# EAGLE schematic newt_mkr_v1_r1 (EAGLE 9.6.2)
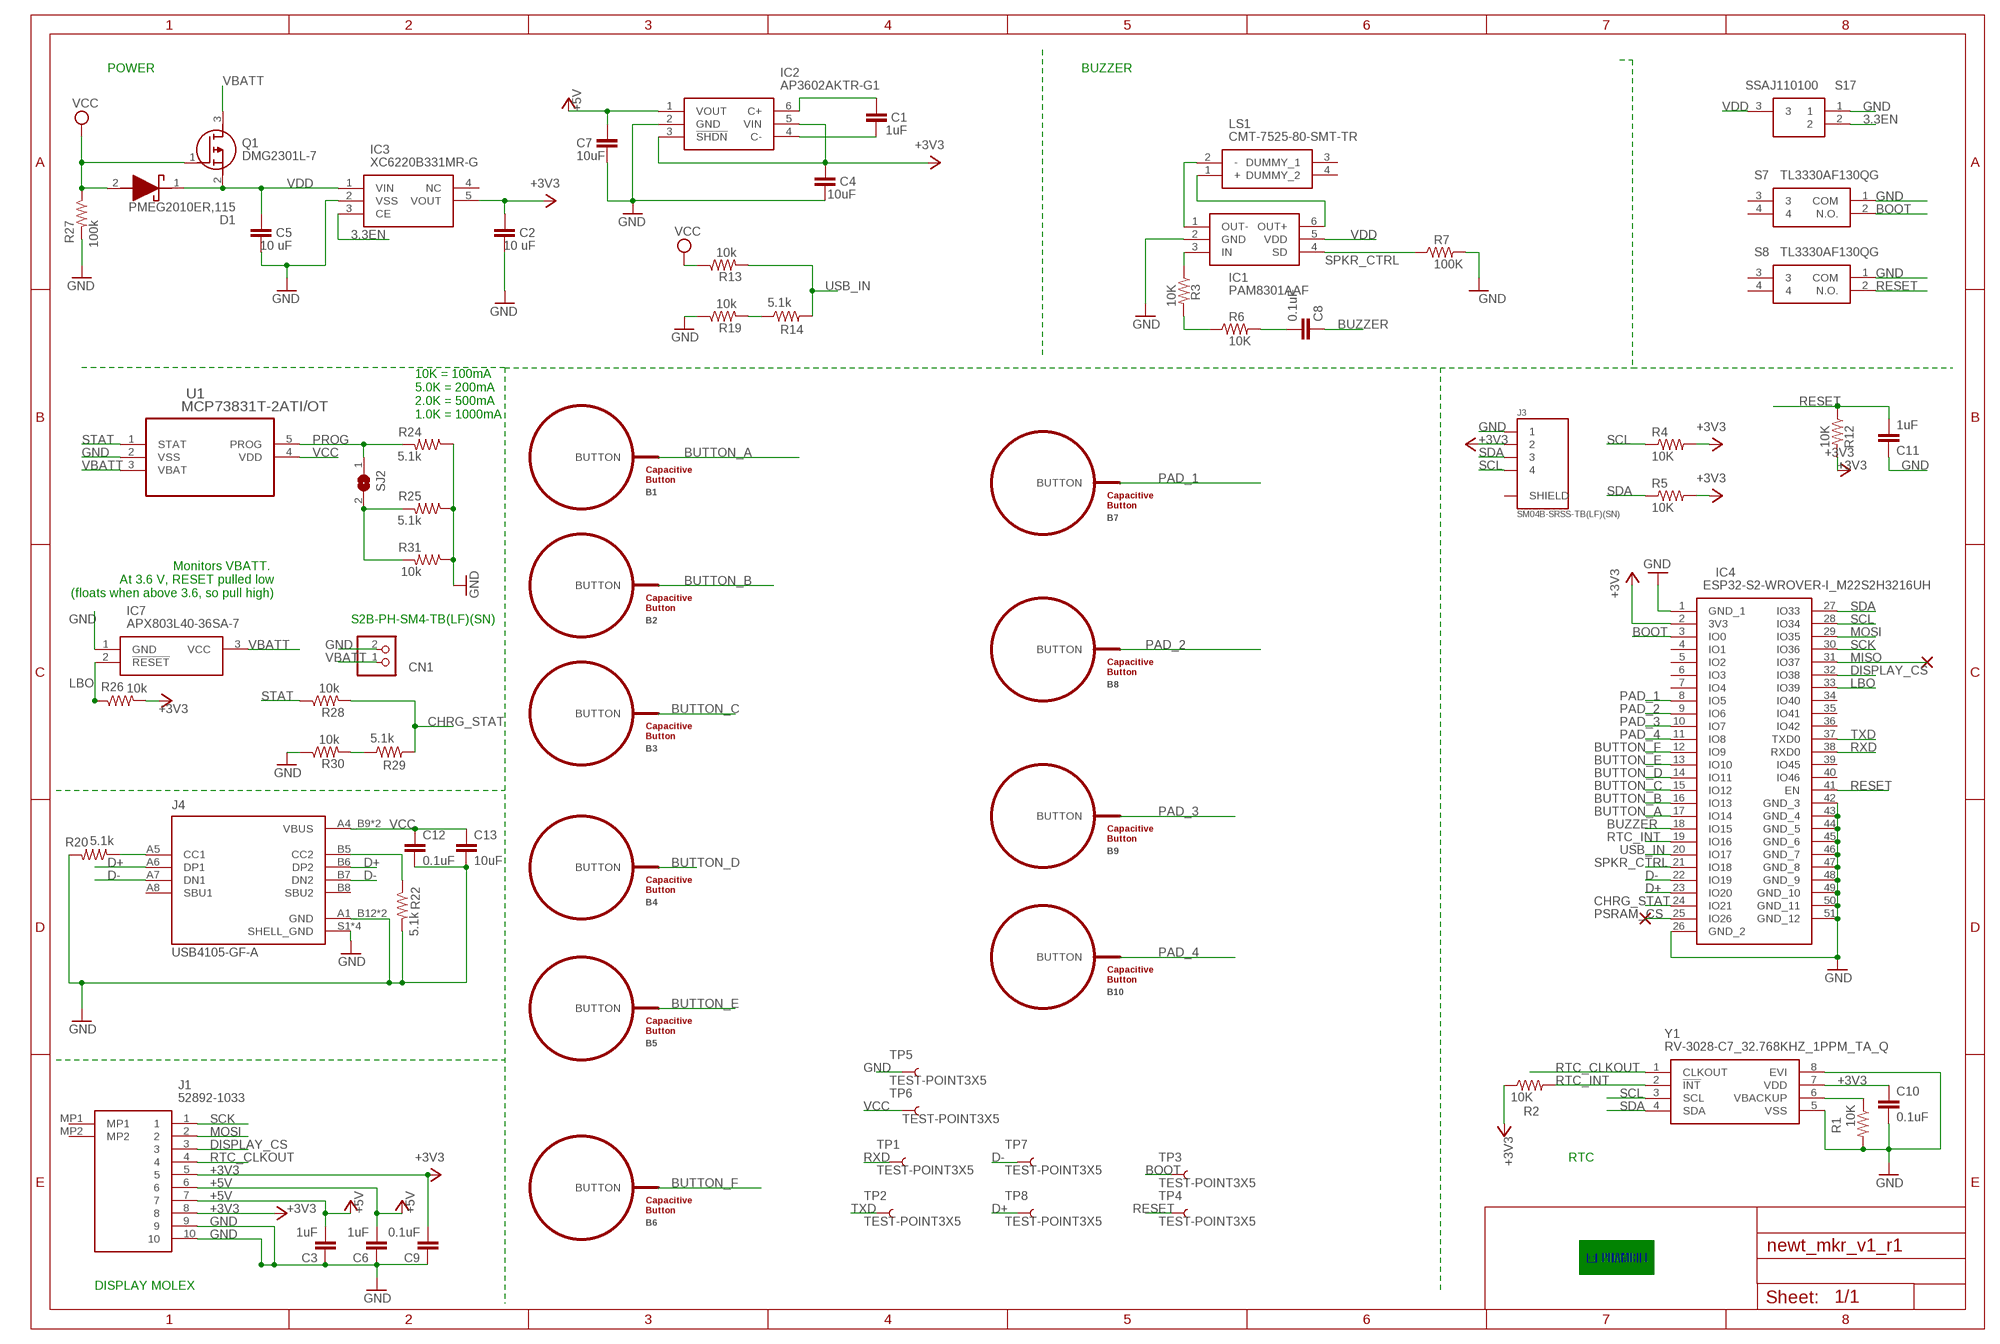
[diagram p0: schematic, sheet 1]

## Parts
B1  BUTTON_PASSIVE6MM  [BUTTON_PASSIVE_6MM]
B2  BUTTON_PASSIVE6MM  [BUTTON_PASSIVE_6MM]
B3  BUTTON_PASSIVE6MM  [BUTTON_PASSIVE_6MM]
B4  BUTTON_PASSIVE6MM  [BUTTON_PASSIVE_6MM]
B5  BUTTON_PASSIVE6MM  [BUTTON_PASSIVE_6MM]
B6  BUTTON_PASSIVE6MM  [BUTTON_PASSIVE_6MM]
B7  BUTTON_PASSIVE10MM  [BUTTON_PASSIVE_10MM]
B8  BUTTON_PASSIVE10MM  [BUTTON_PASSIVE_10MM]
B9  BUTTON_PASSIVE10MM  [BUTTON_PASSIVE_10MM]
B10  BUTTON_PASSIVE10MM  [BUTTON_PASSIVE_10MM]
C1  1uF  CC0603  [C0603]
C2  10 uF  CC0603  [C0603]
C3  1uF  CC0603  [C0603]
C4  10uF  CC0603  [C0603]
C5  10 uF  CC0603  [C0603]
C6  1uF  CC0603  [C0603]
C7  10uF  CC0603  [C0603]
C8  0.1uF  CC0603  [C0603]
C9  0.1uF  CC0603  [C0603]
C10  0.1uF  CC0603  [C0603]
C11  1uF  CC0603  [C0603]
C12  0.1uF  CC0603  [C0603]
C13  10uF  CC0603  [C0603]
CN1  JST_2PIN-SMT-RA  [JST-PH-2-SMT-RA]
D1  PMEG2010ER,115  [SODFL3517X110N]
IC1  PAM8301AAF  [SOT95P280X145-6N]
IC2  AP3602AKTR-G1  [SOT95P280X145-6N]
IC3  XC6220B331MR-G  [SOT95P280X130-5N]
IC4  ESP32-S2-WROVER-I_M22S2H3216UH  [ESP32S2WROVERIM22S2H3216UH3Q0]
IC7  APX803L40-36SA-7  [SOT96P240X110-3N]
J1  52892-1033  [528921033]
J3  SM04B-SRSS-TB(LF)(SN)  [JST_SM04B-SRSS-TB(LF)(SN)]
J4  USB4105-GF-A  [GCT_USB4105-GF-A]
LS1  CMT-7525-80-SMT-TR  [CMT752580SMTTR]
Q1  DMG2301L-7  [SOT96P240X110-3N]
R1  10K  R-US_R0603  [R0603]
R2  10K  R-US_R0603  [R0603]
R3  10K  R-US_R0603  [R0603]
R4  10K  R-US_R0603  [R0603]
R5  10K  R-US_R0603  [R0603]
R6  10K  R-US_R0603  [R0603]
R7  100K  R-US_R0603  [R0603]
R12  10K  R-US_R0603  [R0603]
R13  10k  R-US_R0603  [R0603]
R14  5.1k  R-US_R0603  [R0603]
R19  10k  R-US_R0603  [R0603]
R20  5.1k  R-US_R0603  [R0603]
R22  5.1k  R-US_R0603  [R0603]
R24  5.1k  R-US_R0603  [R0603]
R25  5.1k  R-US_R0603  [R0603]
R26  10k  R-US_R0603  [R0603]
R27  100k  R-US_R0603  [R0603]
R28  10k  R-US_R0603  [R0603]
R29  5.1k  R-US_R0603  [R0603]
R30  10k  R-US_R0603  [R0603]
R31  10k  R-US_R0603  [R0603]
S7  TL3330AF130QG  [TL3330AF130QG]
S8  TL3330AF130QG  [TL3330AF130QG]
S17  SSAJ110100  [SSAJ110100_1]
SJ2  MICROBUILDER_SOLDERJUMPERCLOSED  [MICROBUILDER_SOLDERJUMPER_CLOSEDWIRE]
TP1  TEST-POINT3X5  [PAD.03X.05]
TP2  TEST-POINT3X5  [PAD.03X.05]
TP3  TEST-POINT3X5  [PAD.03X.05]
TP4  TEST-POINT3X5  [PAD.03X.05]
TP5  TEST-POINT3X5  [PAD.03X.05]
TP6  TEST-POINT3X5  [PAD.03X.05]
TP7  TEST-POINT3X5  [PAD.03X.05]
TP8  TEST-POINT3X5  [PAD.03X.05]
U1  MCP73831T-2ATI/OT  [SOT95P300X145-5N]
Y1  RV-3028-C7_32.768KHZ_1PPM_TA_Q  [RV-8803-C7]

## Nets
3.3EN: IC3.3(CE) S17.2
+3V3: C2.2 C4.2 C9.2 C10.1 IC2.3(!SHDN) IC2.5(VIN) IC3.5(VOUT) IC4.2(3V3) J1.5 J1.8 J3.2 R2.1 R4.2 R5.2 R12.2 R26.2 Y1.7(VDD)
+5V: C3.2 C6.2 C7.2 IC2.1(VOUT) J1.6 J1.7
BOOT: IC4.3(IO0) S7.2(N.O.) TP3.P$1
BUTTON_A: B1.BUTTON IC4.17(IO14)
BUTTON_B: B2.BUTTON IC4.16(IO13)
BUTTON_C: B3.BUTTON IC4.15(IO12)
BUTTON_D: B4.BUTTON IC4.14(IO11)
BUTTON_E: B5.BUTTON IC4.13(IO10)
BUTTON_F: B6.BUTTON IC4.12(IO9)
BUZZER: C8.1 IC4.18(IO15)
CC2: J4.B5(CC2) R22.1
CHRG_STAT: IC4.24(IO21) R28.2 R29.2
D+: IC4.23(IO20) J4.A6(DP1) J4.B6(DP2) TP8.P$1
D-: IC4.22(IO19) J4.A7(DN1) J4.B7(DN2) TP7.P$1
DISPLAY_CS: IC4.32(IO38) J1.3
GND: C2.1 C3.1 C4.1 C5.1 C6.1 C7.1 C9.1 C10.2 C11.1 C12.2 C13.2 CN1.2 IC1.2(GND) IC2.2(GND) IC3.2(VSS) IC4.1(GND_1) IC4.26(GND_2) IC4.42(GND_3) IC4.43(GND_4) IC4.44(GND_5) IC4.45(GND_6) IC4.46(GND_7) IC4.47(GND_8) IC4.48(GND_9) IC4.49(GND_10) IC4.50(GND_11) IC4.51(GND_12) IC7.1(GND) J1.9 J1.10 J3.1 J4.A1_B12(GND) J4.B1_A12(GND) J4.S1(SHELL_GND) J4.S2(SHELL_GND) J4.S3(SHELL_GND) J4.S4(SHELL_GND) R1.2 R7.2 R19.1 R20.2 R22.2 R24.1 R25.1 R27.2 R30.1 R31.1 S7.1(COM) S8.1(COM) S17.1 TP5.P$1 U1.2(VSS) Y1.5(VSS) Y1.8(EVI)
LBO: IC4.33(IO39) IC7.2(!RESET) R26.1
MISO: IC4.31(IO37)
MOSI: IC4.29(IO35) J1.2
N$1: IC1.6(OUT+) LS1.1(+)
N$2: IC1.1(OUT-) LS1.2(-)
N$3: R1.1 Y1.6(VBACKUP)
N$4: R14.1 R19.2
N$5: C1.2 IC2.6(C+)
N$6: C1.1 IC2.4(C-)
N$7: IC1.3(IN) R3.1
N$8: R29.1 R30.2
N$11: R25.2 R31.2 SJ2.2
N$12: R3.2 R6.1
N$13: C8.2 R6.2
N$15: J4.A5(CC1) R20.1
PAD_1: B7.BUTTON IC4.8(IO5)
PAD_2: B8.BUTTON IC4.9(IO6)
PAD_3: B9.BUTTON IC4.10(IO7)
PAD_4: B10.BUTTON IC4.11(IO8)
PROG: R24.2 SJ2.1 U1.5(PROG)
PSRAM_CS: IC4.25(IO26)
RESET: C11.2 IC4.41(EN) R12.1 S8.2(N.O.) TP4.P$1
RTC_CLKOUT: J1.4 Y1.1(CLKOUT)
RTC_INT: IC4.19(IO16) R2.2 Y1.2(!INT)
RXD: IC4.38(RXD0) TP1.P$1
SCK: IC4.30(IO36) J1.1
SCL: IC4.28(IO34) J3.4 R4.1 Y1.3(SCL)
SDA: IC4.27(IO33) J3.3 R5.1 Y1.4(SDA)
SPKR_CTRL: IC1.4(SD) IC4.21(IO18) R7.1
STAT: R28.1 U1.1(STAT)
TXD: IC4.37(TXD0) TP2.P$1
USB_IN: IC4.20(IO17) R13.2 R14.2
VBATT: CN1.1 IC7.3(VCC) Q1.3(D) U1.3(VBAT)
VCC: C12.1 C13.1 D1.2(A) J4.A4_B9(VBUS) J4.B4_A9(VBUS) Q1.1(G) R13.1 R27.1 TP6.P$1 U1.4(VDD)
VDD: C5.2 D1.1(K) IC1.5(VDD) IC3.1(VIN) Q1.2(S) S17.3
Unconnected: IC3.4(NC) IC4.4(IO1) IC4.5(IO2) IC4.6(IO3) IC4.7(IO4) IC4.34(IO40) IC4.35(IO41) IC4.36(IO42) IC4.39(IO45) IC4.40(IO46) J1.MP1 J1.MP2 J3.S1(SHIELD) J3.S2(SHIELD) J4.A8(SBU1) J4.B8(SBU2) LS1.3(DUMMY_1) LS1.4(DUMMY_2) S7.3 S7.4 S8.3 S8.4

## Notes on the sheet
- POWER | BUZZER
- 10K = 100mA
  5.0K = 200mA
  2.0K = 500mA
  1.0K = 1000mA
- Monitors VBATT. 
  At 3.6 V, RESET pulled low
  (floats when above 3.6, so pull high)
- S2B-PH-SM4-TB(LF)(SN)‎
- RTC
- DISPLAY MOLEX

## Library data of the parts
B1-B10 = PatternAgents-TouchWidgets:BUTTON_PASSIVE: Button, Passive Capacitive/Touch Sensing Type Source : http://www.PatternAgents.com Github : https://github.com/PatternAgents License : http://creativecommons.org/licenses/by-sa/3.1/ (Creative Commons 3.1) THIS SOFTWARE IS PROVIDED BY THE CONTRIBUTORS "AS IS" AND WITHOUT ANY EXPRESS OR IMPLIED WARRANTIES, INCLUDING, BUT NOT LIMITED TO, THE IMPLIED WARRANTIES OF MERCHANTABILITY AND FITNESS FOR A PARTICULAR PURPOSE ARE DISCLAIMED. IN NO EVENT SHALL THE COPYRIGHT OWNER OR CONTRIBUTORS BE LIABLE FOR ANY DIRECT, INDIRECT, INCIDENTAL, SPECIAL, EXEMPLARY, OR CONSEQUENTIAL DAMAGES (INCLUDING, BUT NOT LIMITED TO, PROCUREMENT OF SUBSTITUTE GOODS OR SERVICES; LOSS OF USE, DATA, OR PROFITS; OR BUSINESS INTERRUPTION) HOWEVER CAUSED AND ON ANY THEORY OF LIABILITY, WHETHER IN CONTRACT, STRICT LIABILITY, OR TORT (INCLUDING NEGLIGENCE OR OTHERWISE) ARISING IN ANY WAY OUT OF THE USE OF THIS SOFTWARE, EVEN IF ADVISED OF THE POSSIBILITY OF SUCH DAMAGE.
C1-C13 = eagle-ltspice:C: CAPACITOR, European symbol; SPICEMODEL: NONE; SPICEPREFIX: C
CN1 = adafruit:JST_2PIN: JST 2-Pin Connectors of various flavors SMT-RA (S2B-PH-SM4) 4UConnector #17311 SMT (B2B-PH-SM4) THM-RA (S2B-PH) THM (B2B-PH)
D1 = PMEG2010ER_115:PMEG2010ER,115: NXP PMEG2010ER,115 SMT Schottky Diode, 20V 1A, 2-Pin SOD-123 Source: Datasheet <https://assets.nexperia.com/documents/data-sheet/PMEG2010ER.pdf>; DESCRIPTION: NXP PMEG2010ER,115 SMT Schottky Diode, 20V 1A, 2-Pin SOD-123; HEIGHT: 1.1mm; MANUFACTURER_NAME: Nexperia; MANUFACTURER_PART_NUMBER: PMEG2010ER,115; MOUSER_PART_NUMBER: 771-PMEG2010ER115; MOUSER_PRICE-STOCK: https://www.mouser.co.uk/ProductDetail/Nexperia/PMEG2010ER115?qs=LMSg3oBIm%2FjLN28PGE8ULg%3D%3D
IC1 = PAM8301AAF:PAM8301AAF: Audio Amplifiers 1.5W MONO FILTERLESS CLASS-D AUDIO AMP Source: Datasheet <https://www.diodes.com/assets/Datasheets/PAM8301.pdf>; DESCRIPTION: Audio Amplifiers 1.5W MONO FILTERLESS CLASS-D AUDIO AMP; HEIGHT: 1.45mm; MANUFACTURER_NAME: Diodes Inc.; MANUFACTURER_PART_NUMBER: PAM8301AAF; MOUSER_PART_NUMBER: 621-PAM8301AAF; MOUSER_PRICE-STOCK: https://www.mouser.co.uk/ProductDetail/Diodes-Incorporated/PAM8301AAF?qs=pYVYkI7xuRV6vlW3YKulRw%3D%3D
IC2 = AP3602AKTR-G1:AP3602AKTR-G1: Switching Voltage Regulators LED Backlight Source: Datasheet <https://media.digikey.com/pdf/Data Sheets/Diodes PDFs/AP3602A_B.pdf>; DESCRIPTION: Switching Voltage Regulators LED Backlight; HEIGHT: 1.45mm; MANUFACTURER_NAME: Diodes Inc.; MANUFACTURER_PART_NUMBER: AP3602AKTR-G1; MOUSER_PART_NUMBER: 621-AP3602AKTR-G1; MOUSER_PRICE-STOCK: https://www.mouser.co.uk/ProductDetail/Diodes-Incorporated/AP3602AKTR-G1?qs=5V6w%252Be2aIqZe7SZnxovZqw%3D%3D
IC3 = XC6220B331MR-G:XC6220B331MR-G: TOREX - XC6220B331MR-G - IC, LDO, 1A, 3.3V, SOT-25 Source: Datasheet <https://media.digikey.com/pdf/Data Sheets/Torex/XC6220.pdf>; DESCRIPTION: TOREX - XC6220B331MR-G - IC, LDO, 1A, 3.3V, SOT-25; HEIGHT: 1.3mm; MANUFACTURER_NAME: Torex; MANUFACTURER_PART_NUMBER: XC6220B331MR-G; MOUSER_PART_NUMBER: 865-XC6220B331MR-G; MOUSER_PRICE-STOCK: https://www.mouser.co.uk/ProductDetail/Torex-Semiconductor/XC6220B331MR-G?qs=AsjdqWjXhJ8lRh0WBUyqoQ%3D%3D
IC4 = ESP32-S2-WROVER-I_M22S2H3216UH:ESP32-S2-WROVER-I_M22S2H3216UH: WiFi Modules (802.11) Module ESP32-S2 WROVER IPEX ANT Source: Datasheet <https://www.google.com/url?sa=t&rct=j&q=&esrc=s&source=web&cd=&cad=rja&uact=8&ved=2ahUKEwj0ocKbgujsAhUKSBUIHTeZARUQFjACegQIDBAC&url=https://www.espressif.com/sites/default/files/documentation/esp32-s2-wrover_esp32-s2-wrover-i_datasheet_en.>; DESCRIPTION: WiFi Modules (802.11) Module ESP32-S2 WROVER IPEX ANT; HEIGHT: 3.45mm; MANUFACTURER_NAME: Espressif Systems; MANUFACTURER_PART_NUMBER: ESP32-S2-WROVER-I(M22S2H3216UH3Q0); MOUSER_PART_NUMBER: 356-ESP32S2WRVI321PH; MOUSER_PRICE-STOCK: https://www.mouser.co.uk/ProductDetail/Espressif-Systems/ESP32-S2-WROVER-IM22S2H3216UH3Q0/?qs=vHuUswq2%252BszxnrhiZVBtvw%3D%3D
IC7 = APX803L40-36SA-7:APX803L40-36SA-7: Supervisory Circuits 3.6V, 450ms Reset Ge nerator Source: Datasheet; DESCRIPTION: Supervisory Circuits 3.6V, 450ms Reset Ge nerator; HEIGHT: 1.1mm; MANUFACTURER_NAME: Diodes Inc.; MANUFACTURER_PART_NUMBER: APX803L40-36SA-7
J1 = 52892-1033:52892-1033: MOLEX - 52892-1033 - FFC / FPC Board Connector, ZIF, 0.5 mm, 10 Contacts, Receptacle, Easy-On 52892 Series Source: Datasheet <https://componentsearchengine.com/Datasheets/2/52892-1033.pdf>; DESCRIPTION: MOLEX - 52892-1033 - FFC / FPC Board Connector, ZIF, 0.5 mm, 10 Contacts, Receptacle, Easy-On 52892 Series; HEIGHT: 2mm; MANUFACTURER_NAME: Molex; MANUFACTURER_PART_NUMBER: 52892-1033; MOUSER_PART_NUMBER: 538-52892-1033; MOUSER_PRICE-STOCK: https://www.mouser.co.uk/ProductDetail/Molex/52892-1033/?qs=s7UCm7gO1bYFQIHRMDmdTA%3D%3D
J3 = SM04B-SRSS-TB_LF__SN_:SM04B-SRSS-TB(LF)(SN): SH Series 1.0 mm Pitch 2 Position Single Row Side Entry Shrouded Header; DESCRIPTION: Connector Header Surface Mount, Right Angle 4 position 0.039 (1.00mm); DIGI-KEY_PART_NUMBER: 455-1804-1-ND; MF: JST Sales; MP: SM04B-SRSS-TB(LF)(SN); PACKAGE: None; PURCHASE-URL: https://pricing.snapeda.com/search/part/SM04B-SRSS-TB(LF)(SN)/?ref=eda
J4 = USB4105-GF-A:USB4105-GF-A: USB-C (USB TYPE-C) USB 2.0 Receptacle Connector 24 (16+8 Dummy) Position Surface Mount, Right Angle; Through Hole Check prices <https://pricing.snapeda.com/parts/USB4105-GF-A/GCT/view-part?ref=eda>; AVAILABILITY: In Stock; DESCRIPTION: USB-C (USB TYPE-C) USB 2.0 Receptacle Connector 24 (16+8 Dummy) Position Surface Mount, Right Angle; Through Hole; MF: GCT; MP: USB4105-GF-A; PACKAGE: None; PRICE: None; PURCHASE-URL: https://pricing.snapeda.com/search/part/USB4105-GF-A/?ref=eda
LS1 = CMT-7525-80-SMT-TR:CMT-7525-80-SMT-TR: Piezo Buzzers & Audio Indicators buzzer, 7.5 mm, 2.5 mm deep, M, 3.6 V, 80 dB, Surface Mount (SMT), Audio Transducer Source: Datasheet <https://www.cuidevices.com/product/resource/cmt-7525-80-smt-tr.pdf>; DESCRIPTION: Piezo Buzzers & Audio Indicators buzzer, 7.5 mm, 2.5 mm deep, M, 3.6 V, 80 dB, Surface Mount (SMT), Audio Transducer; HEIGHT: 2.7mm; MANUFACTURER_NAME: CUI Inc.; MANUFACTURER_PART_NUMBER: CMT-7525-80-SMT-TR; MOUSER_PART_NUMBER: 490-CMT-7525-80SMTTR; MOUSER_PRICE-STOCK: https://www.mouser.co.uk/ProductDetail/CUI-Devices/CMT-7525-80-SMT-TR?qs=P1JMDcb91o5izP7Xira9ww%3D%3D
Q1 = DMG2301L-7:DMG2301L-7: MOSFET MOSFET BVDSS Source: Datasheet; DESCRIPTION: MOSFET MOSFET BVDSS; HEIGHT: 1.1mm; MANUFACTURER_NAME: Diodes Inc.; MANUFACTURER_PART_NUMBER: DMG2301L-7; MOUSER_PART_NUMBER: 621-DMG2301L-7; MOUSER_PRICE-STOCK: https://www.mouser.co.uk/ProductDetail/Diodes-Incorporated/DMG2301L-7/?qs=60RJRzIpcl8mqpUzCaZuxQ%3D%3D
R1-R7 R12-R14 R19 R20 R22 R24-R31 = adafruit:R-US_: RESISTOR, American symbol
S7 S8 = TL3330AF130QG:TL3330AF130QG: E-SWITCH - TL3330AF130QG - SWITCH, TACTILE, SPST, 50mA, 12VDC Source: Datasheet <https://www.e-switch.com/system/asset/product_line/data_sheet/163/TL3330.pdf>; DESCRIPTION: E-SWITCH - TL3330AF130QG - SWITCH, TACTILE, SPST, 50mA, 12VDC; HEIGHT: 3.4mm; MANUFACTURER_NAME: E-Switch; MANUFACTURER_PART_NUMBER: TL3330AF130QG; MOUSER_PART_NUMBER: 612-TL3330AF130QG; MOUSER_PRICE-STOCK: https://www.mouser.co.uk/ProductDetail/E-Switch/TL3330AF130QG?qs=cyOInwlKnROuSmh9LtfUhw%3D%3D
S17 = SSAJ110100:SSAJ110100: Slide Switches slide switch with location lug Source: Datasheet <http://www.alps.com/prod/info/E/HTML/Switch/Slide/SSAJ/SSAJ110100.html>; DESCRIPTION: Slide Switches slide switch with location lug; HEIGHT: mm; MANUFACTURER_NAME: ALPS; MANUFACTURER_PART_NUMBER: SSAJ110100; MOUSER_PART_NUMBER: 688-SSAJ110100; MOUSER_PRICE-STOCK: https://www.mouser.co.uk/ProductDetail/ALPS/SSAJ110100?qs=35GPJvxY%252Bl7i4HLNNvKQzg%3D%3D
SJ2 = Adafruit AT42QT1010 Breakout:MICROBUILDER_SOLDERJUMPER: SMD Solder JUMPER Solder the two pads together to create a connection, or remove the solder to break it. REFLOW - Use this footprint for solder paste and reflow ovens. WAVE - Use this footprint for hand-soldering (larger pads). CLOSED - Has a trace between the two pads to ensure it is closed by default. The trace needs to be cut to disable the jumper, and can be closed again by creating a solder bridge between the two pads.
TP1-TP8 = SparkFun-Connectors:TEST-POINT: SparkFun Test Points Bare copper test points for troubleshooting or In-Circuit-Testing. These are used by our Production team for verifying production board runs using pogo-pins on test beds. SparkFun Products: SparkFun LSM9DS1 Breakout <https://www.sparkfun.com/products/13284> SparkFun PSOC <https://www.sparkfun.com/products/13714> SparkFun Load Cell Amplifier <https://www.sparkfun.com/products/13879>
U1 = Microchip_By_element14_Batch_1:MCP73831T-2ATI/OT: IC, BATT CHARGER, Li-Ion Li-Polymer, 500 mA; MPN: MCP73831T-2ATI/OT; OC_FARNELL: 1834890; OC_NEWARK: 84R5196; PACKAGE: SOT23-5; SUPPLIER: Microchip
Y1 = RV-3028-C7_32.768kHz_1ppm_TA_Q:RV-3028-C7_32.768KHZ_1PPM_TA_Q: Real Time Clock 32.768kHz I2C Time Acc. 1ppm Source: Datasheet; DESCRIPTION: Real Time Clock 32.768kHz I2C Time Acc. 1ppm; HEIGHT: mm; MANUFACTURER_NAME: Micro Crystal AG; MANUFACTURER_PART_NUMBER: RV-3028-C7 32.768kHz 1ppm TA QA; MOUSER_PART_NUMBER: 428-203603-MG01; MOUSER_PRICE-STOCK: https://www.mouser.co.uk/ProductDetail/Micro-Crystal/RV-3028-C7-32768kHz-1ppm-TA-QA/?qs=u16ybLDytRbtEIHDRVfMwQ%3D%3D